# EAGLE design sb2 (EAGLE 8.3.1)
COMPANY: ADAFRUIT INDUSTRIES; DRAWN: KTOWN; REV: B
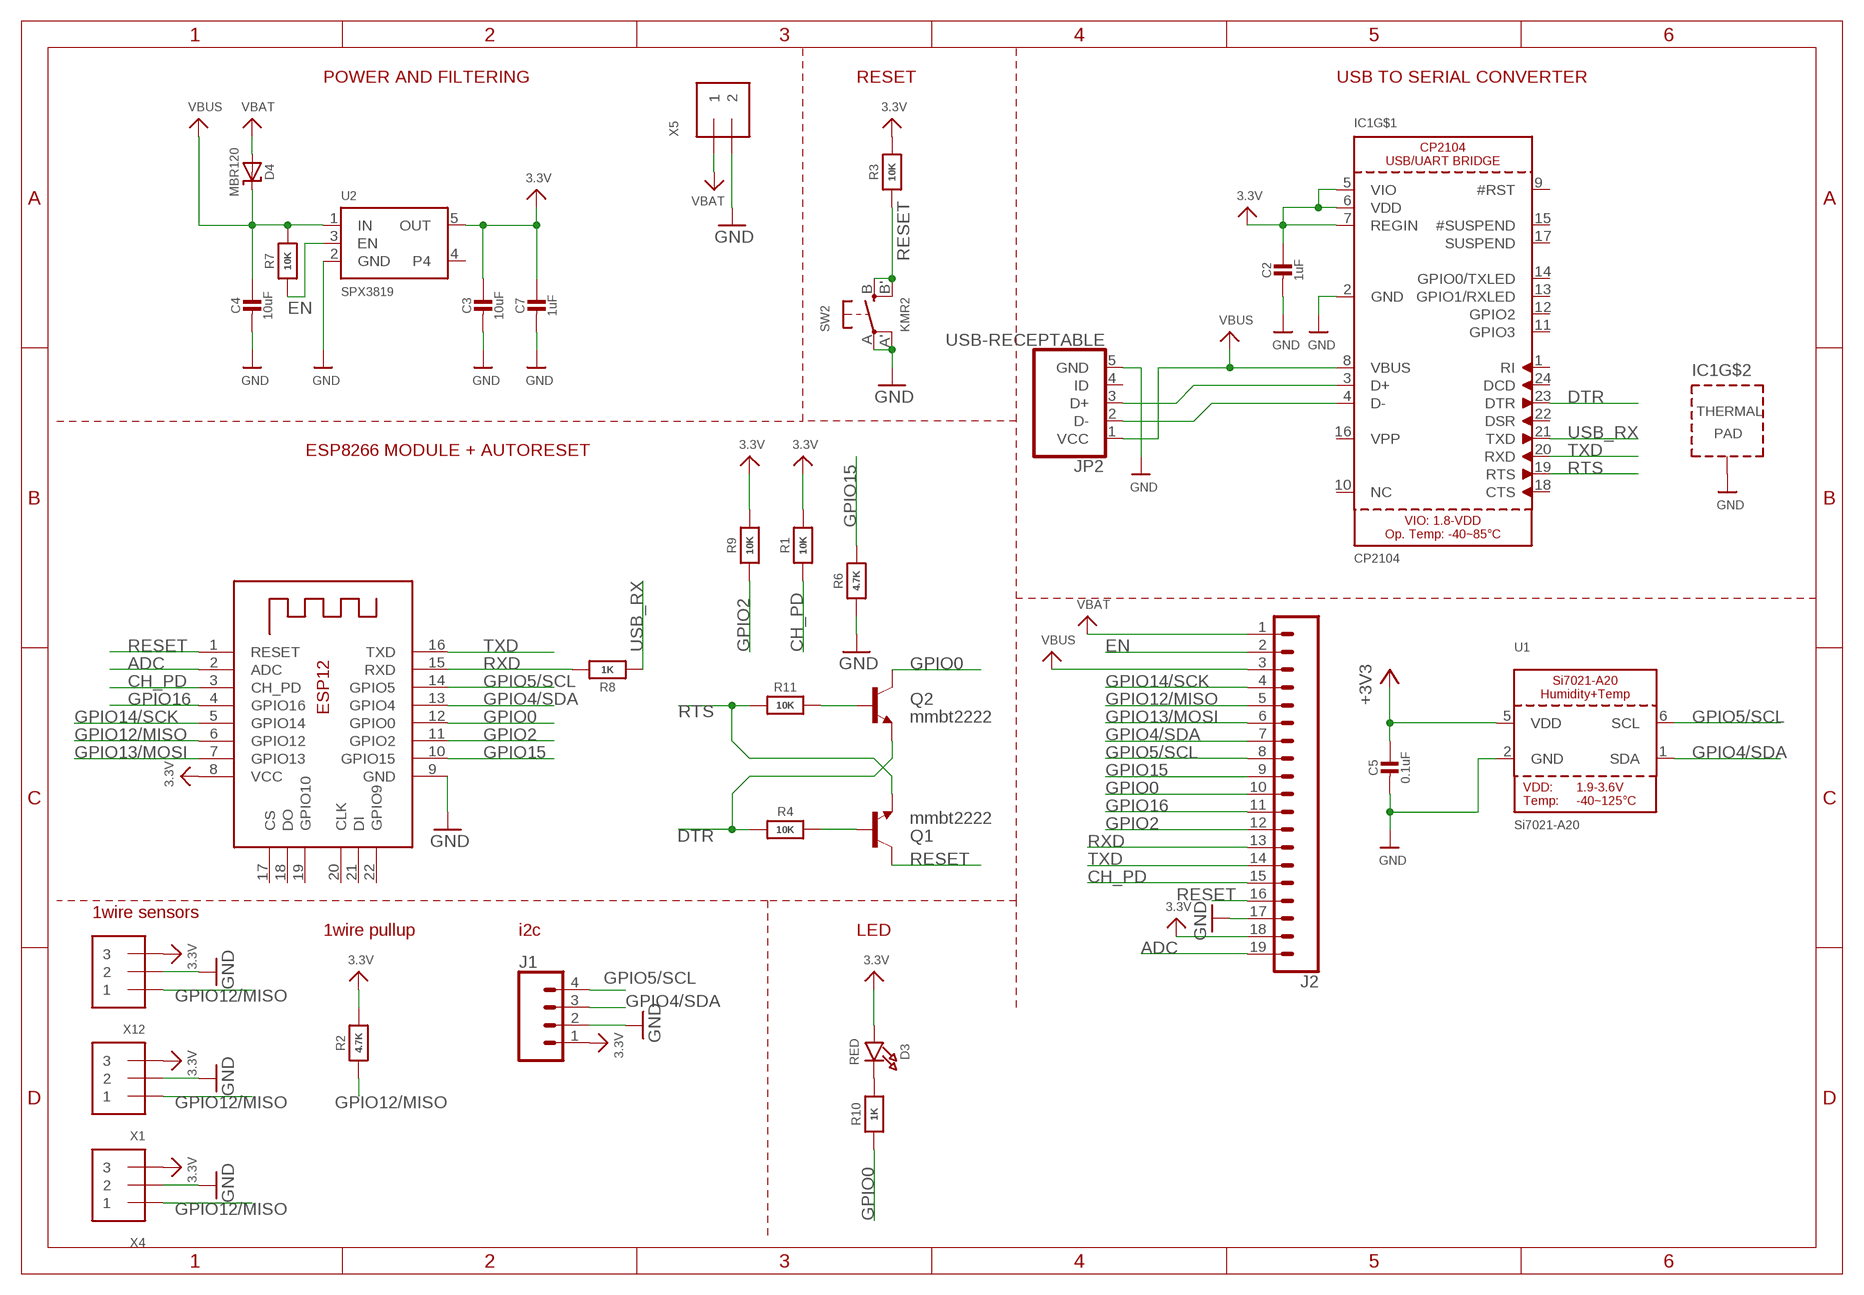
[diagram p0: schematic, sheet 1]

## Parts
C2  1uF  CAP_CERAMIC0603_NO  [0603-NO]
C3  10uF  CAP_CERAMIC0603_NO  [0603-NO]
C4  10uF  CAP_CERAMIC0603_NO  [0603-NO]
C5  0.1uF  CAP_CERAMIC0603_NO  [0603-NO]
C7  1uF  CAP_CERAMIC0603_NO  [0603-NO]
D3  RED  LED0805_NOOUTLINE  [CHIPLED_0805_NOOUTLINE]
D4  MBR120  DIODE-SCHOTTKYSOD-123  [SOD-123]
IC1  CP2104  [QFN24_4MM_SMSC]
J1  CONN_04SCREW  [SCREWTERMINAL-3.5MM-4]
J2  CONN_19  [1X19]
JP2  USB-RECEPTABLE  [FCI-10103594-0001LF]
Q1  mmbt2222  TRANSISTOR_NPNSOT23-3  [SOT23-3]
Q2  mmbt2222  TRANSISTOR_NPNSOT23-3  [SOT23-3]
R1  10K  RESISTOR_0603_NOOUT  [0603-NO]
R2  4.7K  RESISTOR_0603_NOOUT  [0603-NO]
R3  10K  RESISTOR_0603_NOOUT  [0603-NO]
R4  10K  RESISTOR_0603_NOOUT  [0603-NO]
R6  4.7K  RESISTOR_0603_NOOUT  [0603-NO]
R7  10K  RESISTOR_0603_NOOUT  [0603-NO]
R8  1K  RESISTOR_0603_NOOUT  [0603-NO]
R9  10K  RESISTOR_0603_NOOUT  [0603-NO]
R10  1K  RESISTOR_0603_NOOUT  [0603-NO]
R11  10K  RESISTOR_0603_NOOUT  [0603-NO]
SW2  KMR2  SWITCH_TACT_SMT4.6X2.8  [BTN_KMR2_4.6X2.8]
U1  Si7021-A20  SI7021-A20  [DFN6_3X3_SI]
U2  SPX3819  VREG_SOT23-5  [SOT23-5]
X1  TERMBLOCK_1X3  [TERMBLOCK_1X3-3.5MM]
X2  ESP-12  ESP-12E  [ESP-12E]
X4  TERMBLOCK_1X3  [TERMBLOCK_1X3-3.5MM]
X5  TERMBLOCK_1X2  [TERMBLOCK_1X2-3.5MM]
X12  TERMBLOCK_1X3  [TERMBLOCK_1X3-3.5MM]

## Nets
3.3V: C2.1 C3.1 C7.1 D3.A IC1.5(VIO) IC1.6(VDD) IC1.7(REGIN) J1.1 J2.18 R1.2 R2.2 R3.2 R9.2 U2.5(OUT) X1.3 X2.8(VCC) X4.3 X12.3
+3V3: C5.1 U1.5(VDD)
ADC: J2.19 X2.2(ADC)
CH_PD: J2.15 R1.1 X2.3(CH_PD)
DTR: IC1.23(DTR) Q2.2(E) R4.1
EN: J2.2 R7.1 U2.3(EN)
GND: C2.2 C3.2 C4.2 C5.2 C7.2 IC1.2(GND) IC1.THERM(TP) J1.2 J2.17 JP2.5(GND) R6.1 SW2.A'(P1) SW2.A(P) U1.2(GND) U2.2(GND) X1.2 X2.9(GND) X4.2 X5.2 X12.2
GPIO0: J2.10 Q2.3(C) R10.1 X2.12(GPIO0)
GPIO2: J2.12 R9.1 X2.11(GPIO2)
GPIO4/SDA: J1.3 J2.7 U1.1(SDA) X2.13(GPIO4)
GPIO5/SCL: J1.4 J2.8 U1.6(SCL) X2.14(GPIO5)
GPIO12/MISO: J2.5 R2.1 X1.1 X2.6(GPIO12) X4.1 X12.1
GPIO13/MOSI: J2.6 X2.7(GPIO13)
GPIO14/SCK: J2.4 X2.5(GPIO14)
GPIO15: J2.9 R6.2 X2.10(GPIO15)
GPIO16: J2.11 X2.4(GPIO16)
N$2: IC1.3(D+) JP2.3(D+)
N$5: D3.C R10.2
N$6: IC1.4(D-) JP2.2(D-)
N$12: Q1.1(B) R4.2
N$13: Q2.1(B) R11.2
RESET: J2.16 Q1.3(C) R3.1 SW2.B'(S1) SW2.B(S) X2.1(RESET)
RTS: IC1.19(RTS) Q1.2(E) R11.1
RXD: J2.13 R8.2 X2.15(RXD)
TXD: IC1.20(RXD) J2.14 X2.16(TXD)
USB_RX: IC1.21(TXD) R8.1
VBAT: D4.A J2.1 X5.1
VBUS: C4.1 D4.C IC1.8(VBUS) J2.3 JP2.1(VCC) R7.2 U2.1(IN)
Unconnected: IC1.1(RI) IC1.9(#RST) IC1.10(NC) IC1.11(GPIO3) IC1.12(GPIO2) IC1.13(GPIO1/RXLED) IC1.14(GPIO0/TXLED) IC1.15(#SUSPEND) IC1.16(VPP) IC1.17(SUSPEND) IC1.18(CTS) IC1.22(DSR) IC1.24(DCD) JP2.4(ID) U2.4 X2.17(CS) X2.18(DO) X2.19(GPIO10) X2.20(CLK) X2.21(DI) X2.22(GPIO9)

## Notes on the sheet
- POWER AND FILTERING | RESET | USB TO SERIAL CONVERTER
- ESP8266 MODULE + AUTORESET
- 1wire sensors
- 1wire pullup | i2c | LED

## Library data of the parts
C2-C5 C7 = microbuilder:CAP_CERAMIC: Ceramic Capacitors For new designs, use the packages preceded by an '_' character since they are more reliable: The following footprints should be used on most boards: _0402 - Standard footprint for regular board layouts _0603 - Standard footprint for regular board layouts _0805 - Standard footprint for regular board layouts _1206 - Standard footprint for regular board layouts For extremely tight-pitch boards where space is at a premium, the following 'micro-pitch' footprints can be used (smaller pads, no silkscreen outline, etc.): _0402MP - Micro-pitch footprint for very dense/compact boards _0603MP - Micro-pitch footprint for very dense/compact boards _0805MP - Micro-pitch footprint for very dense/compact boards _1206MP - Micro-pitch footprint for very dense/compact boards
D3 = microbuilder:LED: LED 0603 - 0603 Surface Mount Package 2mA: Green LED - Low Power (3.9mcd, 2ma, 1.7Vf) - Digikey: 475-2709-2-ND Orange LED - Low Power (9.8mcd, 2ma, 1.8Vf) - Digikey: 475-1194-2-ND Red LED - Low Power (5mcd, 2ma, 1.8Vf) - Digikey: 475-1195-2-ND Yellow LED - Low Power (7mcd, 2ma, 1.8Vf) - Digikey: 475-1196-2-ND 5mA: Blue LED - Low Power (17mcd, 5ma, 2.9Vf) - Digikey: LNJ937W8CRACT-ND 0805 - 0805 Surface Mount Package 2mA: Red LED (8.8mcd, 2mA, 1.8Vf, Clear) - Low Power [Digikey: 475-2510-1-ND] Green LED (5mcd, 2mA, 1.8Vf, Clear) - Low Power [Digikey: 475-2730-1-ND] Yellow LED (11.3mcd, 2mA, 1.8Vf, Clear) - Low Power [Digikey: 475-2555-1-ND] 20mA: Red LED (104mcd, 20mA, Diffused) - LS R976 [Digikey: 475-1278-6-ND] Red LED (12mcd, 20mA, 2.0Vf, Clear) - APT2012EC [Digikey: 754-1128-1-ND] Green LED (15mcd, 20mA, 2.2Vf, Clear) - APT2012GC [Digikey: 754-1131-1-ND] Orange LED (160mcd, 20mA, 2.1Vf, Clear) - APT2012SECK [Digikey: 754-1130-1-ND] 1206 - 1206 Surface Mount Package Green LED (26mcd, 20mA, Diffused) - LG N971 [Digikey: 475-1407-6-ND] Red LED (15mcd, 20mA, Diffused) - LH N974 [Digikey: 475-1416-6-ND] Cree - Cree High-Power Surface Mount LEDs XPEBWT-L1-0000-00D50 - White 111lm 350mA 2.9Vf 6200K 110° XTEAWT-00-0000-00000LEE3 - White 114lm 350mA 2.85Vf 5000K 115° Everlight - Everlight 45-21 Series Surface Mount LEDs 45-21/QK2C-B2832AC2CB2/2T - Warm White 2000mcd 20mA 3.25Vf 3050K 120° 45-21/LK2C-B38452C4CB2/2T - Nuetral White 2000mcd 20mA 3.25Vf 4150K 120° 45-21/LK2C-B50634C6CB2/2T - Cold White 2200mcd 20mA 3.25Vf 5650K 120° PLCC2 Reverse Mount LS T77K-J1L2-1-0-2-R18-Z - Red 11.25mcd 2mA 1.8Vf 630nm 120° LO T77K-L1M2-24-Z - Orange 19.6mcd 2mA 1.8Vf 606nm 120° LY T77K-K2M1-26-Z - Yellow 15.7mcd 2mA 1.8Vf 587nm 120°
D4 = microbuilder:DIODE-SCHOTTKY
IC1 = microbuilder:CP2104: CP2104 - USB to UART Bridge VDD Output: 3.45V
J1 = SparkFun-Connectors:CONN_04: Multi connection point. Often used as Generic Header-pin footprint for 0.1 inch spaced/style header connections On any of the 0.1 inch spaced packages, you can populate with these: Break Away Headers - Straight <https://www.sparkfun.com/products/116> (PRT-00116) Break Away Male Headers - Right Angle <https://www.sparkfun.com/products/553> (PRT-00553) Female Headers <https://www.sparkfun.com/products/115> (PRT-00115) Break Away Headers - Machine Pin <https://www.sparkfun.com/products/117> (PRT-00117) Break Away Female Headers - Swiss Machine Pin <https://www.sparkfun.com/products/743> (PRT-00743) For SCREWTERMINALS and SPRING TERMINALS visit here: Screw Terimnals on SparkFun.com <https://www.sparkfun.com/search/results?term=Screw+Terminals> (5mm/3.5mm/2.54mm spacing) This device is also useful as a general connection point to wire up your design to another part of your project. Our various solder wires solder well into these plated through hole pads. Hook-Up Wire - Assortment (Stranded, 22 AWG) <https://www.sparkfun.com/products/11375> (PRT-11375) Hook-Up Wire - Assortment (Solid Core, 22 AWG) <https://www.sparkfun.com/products/11367> (PRT-11367) View the entire wire category on our website here <https://www.sparkfun.com/categories/141> Special notes: Molex polarized connector foot print use with SKU : PRT-08231 with associated crimp pins and housings. 1MM SMD Version SKU: PRT-10208; PROD_ID: 2xCONN-08399; SF_ID: 2xPRT-08084
J2 = SparkFun-Connectors:CONN_19: Multi connection point. Often used as Generic Header-pin footprint for 0.1 inch spaced/style header connections On any of the 0.1 inch spaced packages, you can populate with these: Break Away Headers - Straight <https://www.sparkfun.com/products/116> (PRT-00116) Break Away Male Headers - Right Angle <https://www.sparkfun.com/products/553> (PRT-00553) Female Headers <https://www.sparkfun.com/products/115> (PRT-00115) Break Away Headers - Machine Pin <https://www.sparkfun.com/products/117> (PRT-00117) Break Away Female Headers - Swiss Machine Pin <https://www.sparkfun.com/products/743> (PRT-00743) For SCREWTERMINALS and SPRING TERMINALS visit here: Screw Terimnals on SparkFun.com <https://www.sparkfun.com/search/results?term=Screw+Terminals> (5mm/3.5mm/2.54mm spacing) This device is also useful as a general connection point to wire up your design to another part of your project. Our various solder wires solder well into these plated through hole pads. Hook-Up Wire - Assortment (Stranded, 22 AWG) <https://www.sparkfun.com/products/11375> (PRT-11375) Hook-Up Wire - Assortment (Solid Core, 22 AWG) <https://www.sparkfun.com/products/11367> (PRT-11367) View the entire wire category on our website here <https://www.sparkfun.com/categories/141> Special notes: Molex polarized connector foot print use with SKU : PRT-08231 with associated crimp pins and housings. 1MM SMD Version SKU: PRT-10208 NOTES ON THE VARIANTS LOCK and LOCK_LONGPADS... This footprint was designed to help hold the alignment of a through-hole component (i.e. 6-pin header) while soldering it into place. You may notice that each hole has been shifted either up or down by 0.005 of an inch from it's more standard position (which is a perfectly straight line). This slight alteration caused the pins (the squares in the middle) to touch the edges of the holes. Because they are alternating, it causes a "brace" to hold the component in place. 0.005 has proven to be the perfect amount of "off-center" position when using our standard breakaway headers. Although looks a little odd when you look at the bare footprint, once you have a header in there, the alteration is very hard to notice. Also,if you push a header all the way into place, it is covered up entirely on the bottom side.
JP2 = daspilker:USB-RECEPTABLE: USB Receptable
Q1 Q2 = SparkFun:TRANSISTOR_NPN: Transistor NPN BJT configuration in SOT23 package. MMBT2222 is the common NPN we use. Double check BCE configuration again layout.
R1-R4 R6-R11 = microbuilder:RESISTOR: Resistors For new designs, use the packages preceded by an '_' character since they are more reliable: The following footprints should be used on most boards: _0402 - Standard footprint for regular board layouts _0603 - Standard footprint for regular board layouts _0805 - Standard footprint for regular board layouts _1206 - Standard footprint for regular board layouts For extremely tight-pitch boards where space is at a premium, the following 'micro-pitch' footprints can be used (smaller pads, no silkscreen outline, etc.): _0402MP - Micro-pitch footprint for very dense/compact boards _0603MP - Micro-pitch footprint for very dense/compact boards _0805MP - Micro-pitch footprint for very dense/compact boards _1206MP - Micro-pitch footprint for very dense/compact boards
SW2 = microbuilder:SWITCH_TACT_SMT: SMT Tact Switches 6x6mm - Digikey: P12940SCT-ND KMR2 (4.6x2.8mm) - Digikey: 401-1426-1-ND EVQ-PQHB55 - Light Touch, 160GF (4.5x4.5mm) - Digikey: P8090SCT-ND KMT0 - KMT021 NGJ LHS (etc.) IP68/Waterproof - Digikey: CKN10289CT-ND
U1 = microbuilder:SI7021-A20: Si7021-A20 - I2C Humidity and Temperature Sensor VDD: 1.9-3.6V Operating Temperature: -40~125°C +/-3% RH (max) 0..80% RH Humidity Sensor +/-0.4°C (max-, -10~85°C Temperature Sensor 150uA Active, 60nA Standby
U2 = microbuilder:VREG_SOT23-5: SOT23-5 Fixed Voltage Regulators Part Current Out V Out V In V Dropout θJA (°C/W) TJ (°C) Digikey Part No. ADP121 150mA 3.3V 3.4-5.5V 0.09V @ 150mA -- -- ADP121-AUJZ33R7CT-ND ADP121 150mA 3.0V 3.1-5.5V 0.09V @ 150mA -- -- ADP121-AUJZ30R7CT-ND ADP122 300mA 3.3V 3.4-5.5V 0.085V @ 300mA -- -- ADP122AUJZ-3.3-R7CT-ND ADP1712 300mA 3.3V 3.5-5.5V 0.17V @ 300mA -- -- ADP1712AUJZ-3.3-R7TR-ND AP7311 (Low Cost) 150mA 3.3V 3.5-6V 0.15V @ 150mA -- -- AP7311-33WG-7DICT-ND LD39015M18R 150mA 1.8V 1.9V-5.5V 0.08V @ 100mA -- -- 497-6977-1-ND LP2985A-33DBVR 150mA 3.3V 3.3-16V 0.28V @ 150mA 206 150 296-18479-1-ND MCP1824T-3302E/OT 300mA 3.3V 3.5V-6V 0.2V @ 300mA -- -- MCP1824T-3302E/OTCT-ND MIC5205-2.5YM5 TR 150mA 2.5V 2.7-16V 0.165V @ 150mA -- -- 576-1257-2-ND MIC5205-3.0YM5 TR 150mA 3.0V 3.2V-16V 0.165V @ 150mA -- -- 576-1258-2-ND MIC5205-3.3YM5 TR 150mA 3.3V 3.5V-16V 0.165V @ 150mA -- -- 576-1259-2-ND TPS780330220 150mA 3.3V+2.2V 3.6-5.5V 250mV Max -- -- 296-23332-1-ND TDA3663/N1,135 100mA 3.3V 3.5-45V 0.18V @ 50mA -- -- 568-5343-1-ND Max operating temp can be calculated using θJA, TJ (max junction temperature), and power in watts. Set the "Maximum Ambient Temperature" until it reaches TJ ("Max Junction Temperature"), which is the absolute limit for safe use of the regulator: Heat Sink Temperature Calculator <http://www.daycounter.com/Calculators/Heat-Sink-Temperature-Calculator.phtml> For example, With 12V source into a 3.3V LP2985 and a 30mA load, we are dissipating (12V-3.3V) * 0.03A = 0.261W. With a θJA of 206 °C/W, a TJ of 150°C, and 261mW we can safely use the chip without a heat sink up to 75°C (=147.1°C Junction Temperature).
X1 X4 X12 = microbuilder:TERMBLOCK_1X3: 3.5mm Terminal block http://www.ladyada.net/library/pcb/eaglelibrary.html
X2 = microbuilder:ESP-12E
X5 = microbuilder:TERMBLOCK_1X2: 3.5mm Terminal block http://www.ladyada.net/library/pcb/eaglelibrary.html

## Board
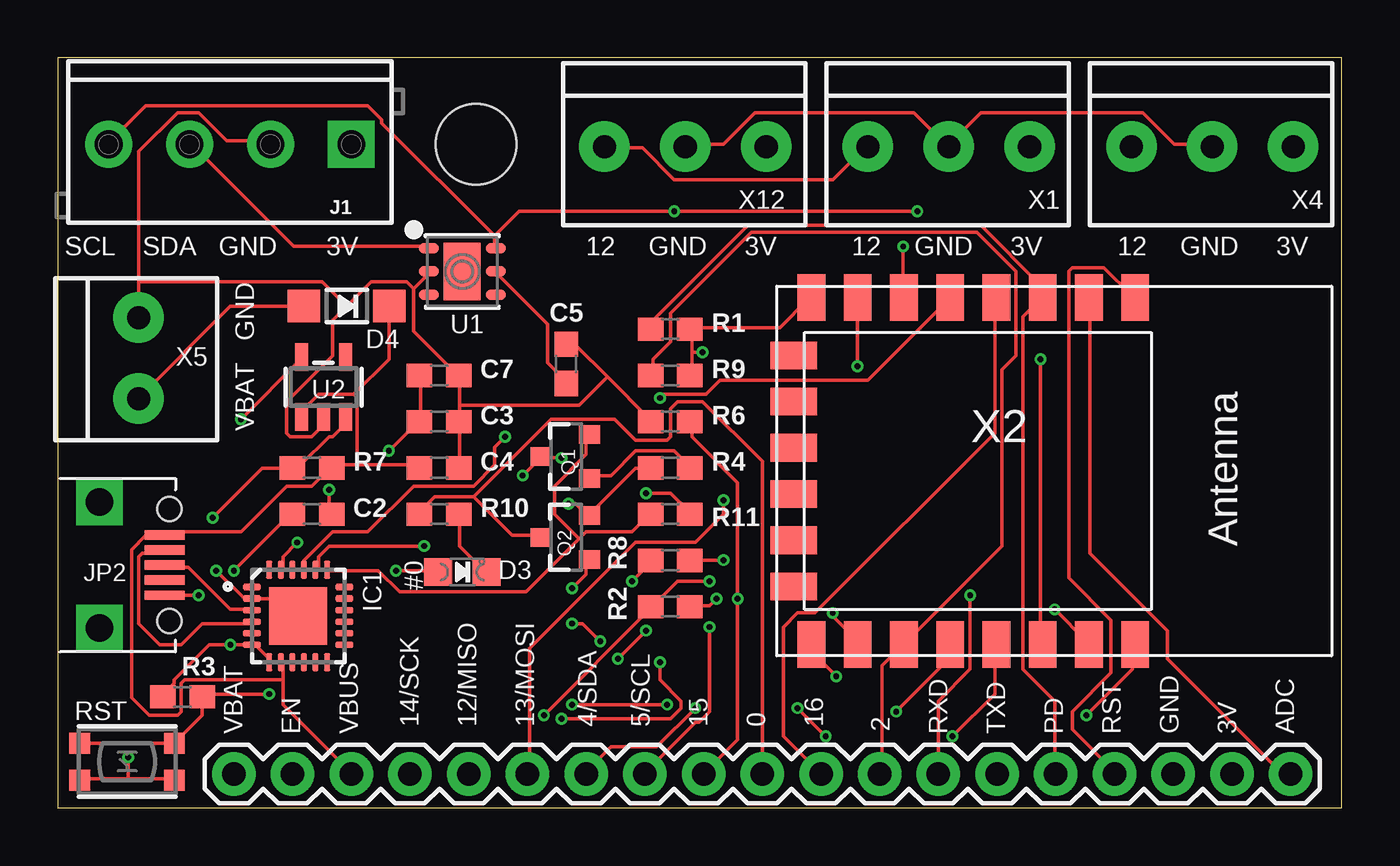
[diagram p1: board, top side]
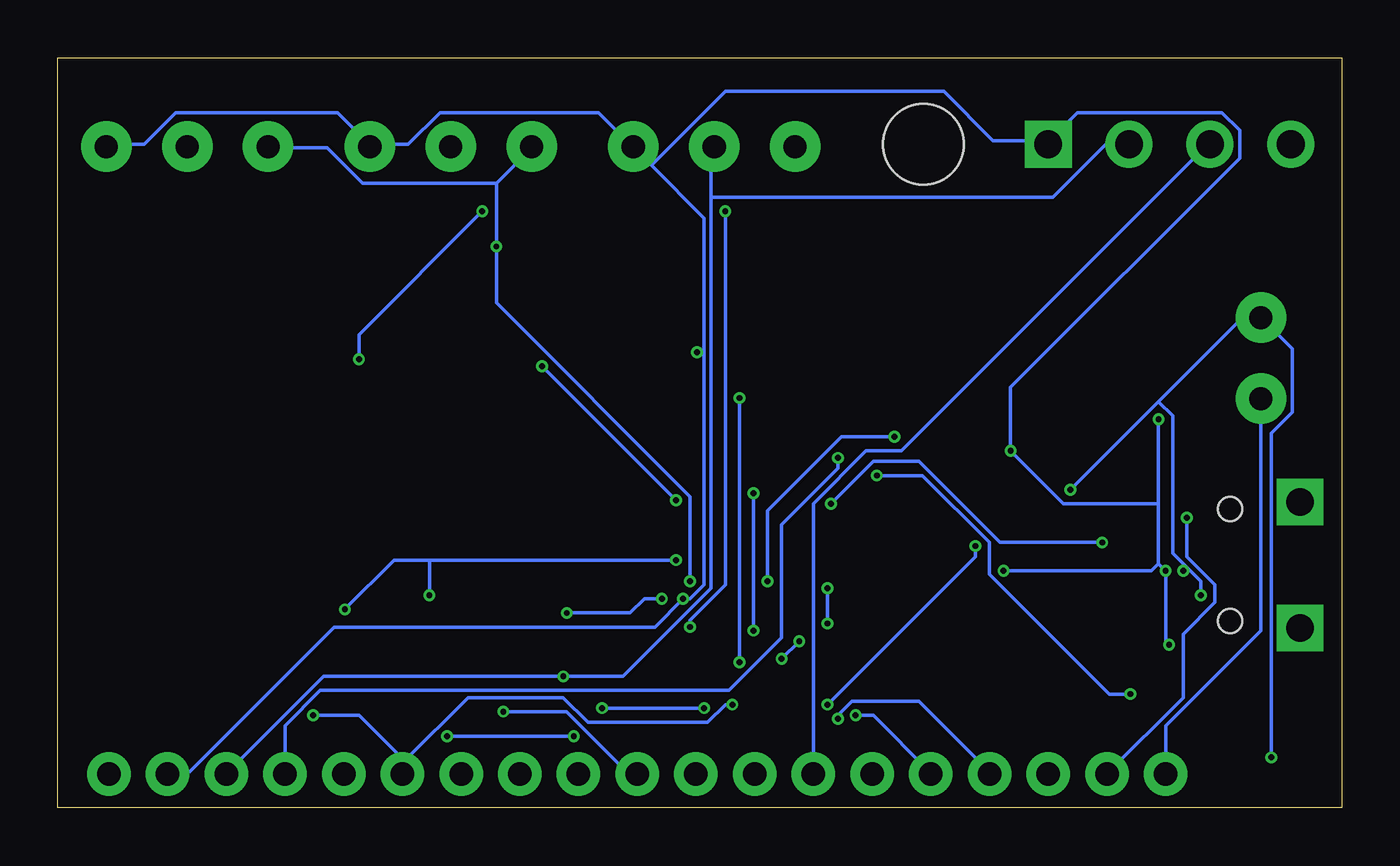
[diagram p2: board, bottom side, seen from below]

Size 55.55 x 32.44 mm. Coordinates in mm from the lower left corner, seen from the top.
Outline: 0,0 55.55,0 55.55,32.44 0,32.44 0,0
Copper layers (1*16): Top 0.035559375mm / dielectric 1.6mm / Bottom 0.035559375mm
Design rules "oshpark-2layer": minimum track width 6mil, minimum drill 10mil, track to track 6mil, track to pad 6mil, pad to pad 6mil, via to via 6mil, smd to smd 6mil, copper to edge 15mil, drill to drill 6mil, minimum pad ring 5mil, minimum via ring 5mil, stop-mask expansion 2.5mil, vias tented up to drill 0mil, thermal gap 10mil
Holes 3.5 mm at 18.1,28.7

### Footprints (pad centres in the part's own frame; a part is rotated, then mirrored left to right if it is on the bottom)
0603-NO = smd 1.1 x 1: 1 -0.85,0; 2 0.85,0
CHIPLED_0805_NOOUTLINE = smd 1.2 x 1.2: A 0,-1.05; C 0,1.05
SOD-123 = smd 1.4 x 1.4: A 1.85,0; C -1.85,0
QFN24_4MM_SMSC = smd 0.8 x 0.28: 1 -2,1.25; 2 -2,0.75; 3 -2,0.25; 4 -2,-0.25; 5 -2,-0.75; 6 -2,-1.25; 13 2,-1.25; 14 2,-0.75; 15 2,-0.25; 16 2,0.25; 17 2,0.75; 18 2,1.25 | smd 0.28 x 0.8: 7 -1.25,-2; 8 -0.75,-2; 9 -0.25,-2; 10 0.25,-2; 11 0.75,-2; 12 1.25,-2; 19 1.25,2; 20 0.75,2; 21 0.25,2; 22 -0.25,2; 23 -0.75,2; 24 -1.25,2 | smd 2.5 x 2.5: THERM 0,0
SCREWTERMINAL-3.5MM-4 = drill 1.2 pad 2.032 square: 1 0,0 | drill 1.2 pad 2.032: 2 3.5,0; 3 7,0; 4 10.5,0
1X19 = drill 1.016 pad 1.88: 1 0,0; 2 2.54,0; 3 5.08,0; 4 7.62,0; 5 10.16,0; 6 12.7,0; 7 15.24,0; 8 17.78,0; 9 20.32,0; 10 22.86,0; 11 25.4,0; 12 27.94,0; 13 30.48,0; 14 33.02,0; 15 35.56,0; 16 38.1,0; 17 40.64,0; 18 43.18,0; 19 45.72,0
FCI-10103594-0001LF = smd 0.4 x 1.75: 1 -1.3,4.525; 2 -0.65,4.525; 3 0,4.525; 4 0.65,4.525; 5 1.3,4.525 | drill 1.2 pad 2 square: P$3 -2.725,1.7; P$4 2.725,1.7 | hole 1.05: -2.425,4.73; 2.425,4.73
SOT23-3 = smd 0.8 x 0.9: 1 -0.95,-1; 2 0.95,-1; 3 0,1.1
BTN_KMR2_4.6X2.8 = smd 0.9 x 0.9: A 2.05,0.8; A' -2.05,0.8; B 2.05,-0.8; B' -2.05,-0.8
DFN6_3X3_SI = smd 0.85 x 0.45: 1 -1.45,1; 2 -1.45,0; 3 -1.45,-1; 4 1.45,-1; 5 1.45,0; 6 1.45,1 | smd 1.6 x 2.5: P$1 0,0
SOT23-5 = smd 0.55 x 1.2: 1 -0.95,-1.3; 2 0,-1.3; 3 0.95,-1.3; 4 0.95,1.3; 5 -0.95,1.3
TERMBLOCK_1X3-3.5MM = drill 1 pad 2.184: 1 3.55,0; 2 0.05,0; 3 -3.45,0
ESP-12E = smd 2 x 1.2: 1 -7.5,5.77; 2 -7.5,3.77; 3 -7.5,1.77; 4 -7.5,-0.23; 5 -7.5,-2.23; 6 -7.5,-4.23; 7 -7.5,-6.23; 8 -7.5,-8.23; 9 7.5,-8.23; 10 7.5,-6.23; 11 7.5,-4.23; 12 7.5,-2.23; 13 7.5,-0.23; 14 7.5,1.77; 15 7.5,3.77; 16 7.5,5.77 | smd 1.2 x 2: 17 -5,-9; 18 -3,-9; 19 -1,-9; 20 1,-9; 21 3,-9; 22 5,-9
TERMBLOCK_1X2-3.5MM = drill 1 pad 2.184: 1 1.8,0; 2 -1.7,0

### Placement (x,y rotation side)
C2  11,12.7 0 top
C3  16.5,16.7 0 top
C4  16.5,14.7 0 top
C5  22,19.2 90 top
C7  16.5,18.7 0 top
D3  17.5,10.2 270 top
D4  12.5,21.7 180 top
IC1  10.4,8.3 0 top
J1  12.7,28.7 180 top
J2  7.62,1.47 0 top
JP2  0.1,10.5 270 top
Q1  22,15.2 90 top
Q2  22,11.7 90 top
R1  26.5,20.7 0 top
R2  26.5,8.7 0 top
R3  5.4,4.8 180 top
R4  26.5,14.7 0 top
R6  26.5,16.7 0 top
R7  11,14.7 0 top
R8  26.5,10.7 0 top
R9  26.5,18.7 0 top
R10  16.5,12.7 0 top
R11  26.5,12.7 0 top
SW2  3,2 180 top
U1  17.5,23.2 0 top
U2  11.5,18.2 0 top
X1  38.6,28.6 180 top
X2  40.84,14.57 270 top
X4  50,28.6 180 top
X5  3.5,19.5 270 top
X12  27.2,28.6 180 top

### Tracks (layer width: path | path; a pad name or v marks a point on that pad's centre or on a via)
3.3V  (via drill 0.25)
  Top 0.152: C7.1 15.7,18.64 15.7,16.81 C3.1 15.54,16.66 v14.33,15.44 | 8.38,7.06 8.38,7.52 IC1.5 | IC1.7 9.14,6.45 8.53,7.06 IC1.6 8.38,7.06 | 8.38,7.06 v7.47,7.06 6.55,7.06 5.03,5.53 5.03,5.38 4.57,4.92 R3.2 | v7.62,10.26 10.06,12.7 C2.1 | v7.92,16.81 10.52,19.4 U2.5 | v14.63,10.26 16.31,10.26 D3.A | 27.43,19.71 27.43,20.62 R1.2 27.43,20.77 31.24,20.77 32.46,21.99 X2.8 | 27.43,19.71 27.43,18.79 R9.2 | v28.5,9.04 28.19,8.73 27.43,8.73 R2.2 | v27.89,19.71 27.43,19.71
  Bottom 0.152: v7.47,7.06 7.62,7.21 v7.62,10.26 7.92,10.56 | 7.92,10.56 7.92,13.15 | 7.92,13.15 v7.92,16.81 | v14.63,10.26 8.23,10.26 7.92,10.56 | 7.92,13.15 12.04,13.15 v14.33,15.44 14.33,18.18 4.42,28.09 4.42,29.31 5.18,30.07 11.43,30.07 12.65,28.85 J1.1 12.8,28.85 15.09,28.85 17.22,30.98 26.67,30.98 29.87,27.78 | 27.58,19.71 27.58,25.5 29.87,27.78 | 27.58,19.71 27.58,9.65 28.19,9.04 v28.5,9.04 29.72,7.82 43.59,7.82 49.84,1.57 50.75,1.57 J2.18 | 29.87,27.78 30.63,28.55 X12.3 30.79,28.7 32.16,30.07 39.01,30.07 40.39,28.7 41.91,28.7 X1.3 42.06,28.7 43.43,30.07 50.44,30.07 51.82,28.7 53.34,28.7 X4.3 | 27.58,19.71 v27.89,19.71
+3V3
  Top 0.152: U1.5 19.05,23.06 21.18,20.93 21.18,19.25 21.95,18.49 C5.1
ADC
  Top 0.152: X2.2 44.65,21.99 44.65,11.02 48.01,7.67 48.01,6.45 52.88,1.57 53.34,1.57 J2.19
CH_PD
  Top 0.152: R1.1 25.76,20.77 25.76,21.08 29.87,25.19 39.93,25.19 42.52,22.6 42.52,22.15 X2.3 42.52,21.99 41.76,21.23 41.76,5.99 43.13,4.62 43.13,1.57 J2.15
DTR  (via drill 0.25)
  Top 0.152: v10.36,11.48 9.75,10.87 9.75,10.41 IC1.23 | v22.1,13.15 22.4,13.15 22.86,12.7 Q2.2 23.01,12.7 24.99,14.68 25.6,14.68 R4.1
  Bottom 0.152: v10.36,11.48 14.78,11.48 18.29,14.98 20.27,14.98 v22.1,13.15
EN  (via drill 0.25)
  Top 0.152: U2.3 12.34,16.81 12.34,16.51 11.89,16.05 11.73,16.05 10.52,14.83 10.21,14.83 R7.1 10.06,14.68 8.84,14.68 v6.71,12.54
  Bottom 0.152: v6.71,12.54 6.71,10.87 5.49,9.65 5.49,8.89 6.86,7.52 6.86,4.77 J2.2
GND  (via drill 0.25)
  Top 0.152: 23.77,18.64 25.6,16.81 R6.1 | 23.77,18.64 22.4,20.01 22.1,20.01 C5.2 | C4.2 17.37,14.83 17.37,16.66 C3.2 17.37,16.81 17.37,17.42 | 15.39,22.45 16,23.06 U1.2 | 15.39,22.45 15.39,20.62 17.22,18.79 C7.2 17.37,18.64 17.37,17.42 | 12.5,21.69 13.56,22.75 15.09,22.75 15.39,22.45 | 12.5,21.69 11.89,21.08 11.89,19.55 9.91,17.57 9.91,16.2 10.06,16.05 10.97,16.05 11.43,16.51 11.43,16.81 U2.2 | 23.77,18.64 22.55,17.42 17.37,17.42 | IC1.THERM 10.36,8.43 9.75,9.04 8.53,9.04 IC1.2 8.38,9.04 8.08,9.04 v6.86,10.26 | 3.05,1.27 5.03,1.27 SW2.A' | 3.05,1.27 1.07,1.27 SW2.A | v11.73,13.76 11.73,12.85 C2.2 | v6.1,9.19 4.72,9.19 JP2.5 | v3.05,2.18 3.05,1.27 | 3.5,22.75 3.5,21.23 X5.2 | 3.5,22.75 3.5,28.39 5.18,30.07 6.1,30.07 7.32,28.85 9.14,28.85 J1.2 | 12.5,21.69 11.43,22.75 3.5,22.75 | v33.68,5.69 32.61,6.75 32.61,7.06 X2.9 | X12.2 27.28,28.7 28.8,28.7 30.18,30.07 37.03,30.07 38.41,28.7 X1.2 38.56,28.7 39.93,30.07 46.94,30.07 48.31,28.7 49.84,28.7 X4.2
  Bottom 0.152: 7.92,17.57 4.42,21.08 3.5,21.08 X5.2 3.35,21.08 2.13,19.86 2.13,17.12 3.05,16.2 v3.05,2.18 | 7.92,17.57 v11.73,13.76 | v6.1,9.19 6.1,9.8 6.71,10.41 | 6.71,10.41 7.32,11.02 7.32,16.96 7.92,17.57 | 6.71,10.41 v6.86,10.26 | J2.17 44.04,5.69 v33.68,5.69 31.09,5.69 27.28,9.5 27.28,26.41 | 27.28,26.41 27.28,28.55 X12.2 | 27.28,26.41 12.5,26.41 10.21,28.7 9.3,28.7 J1.2
GPIO0  (via drill 0.25)
  Top 0.152: 17.98,13.46 19.66,11.78 20.88,11.78 Q2.3 | 17.98,13.46 16.31,13.46 15.7,12.85 R10.1 | v36.27,4.16 38.56,6.45 38.56,7.06 X2.12 | 17.98,13.46 21.34,16.81 24.08,16.81 24.99,15.9 26.36,15.9 26.52,16.05 26.52,17.27 26.82,17.57 27.89,17.57 30.48,14.98 J2.10
  Bottom 0.152: v36.27,4.16 33.53,4.16 30.94,1.57 30.48,1.57 J2.10
GPIO2
  Top 0.152: R9.1 25.76,18.79 25.76,19.4 26.52,20.16 26.52,21.38 30.02,24.89 39.78,24.89 41.45,23.21 41.45,19.55 40.84,18.95 40.84,11.32 36.73,7.21 X2.11 36.58,7.06 35.66,6.14 35.66,1.57 J2.12
GPIO4/SDA  (via drill 0.25)
  Top 0.152: U1.1 16,24.28 10.21,24.28 5.79,28.7 J1.3 | v38.71,3.1 40.54,4.92 40.54,7.06 X2.13 | v32,4.32 v33.22,3.1 | v27.58,4.32 25.91,2.64 23.93,2.64 22.86,1.57 J2.7
  Bottom 0.152: v33.22,3.1 v38.71,3.1 | v27.58,4.32 v32,4.32 | J2.7 22.86,13.15 20.57,15.44 19.05,15.44 5.79,28.7 J1.3
GPIO5/SCL  (via drill 0.25)
  Top 0.152: 18.9,24.74 18.9,24.28 U1.6 | 18.9,24.74 14.02,29.61 14.02,29.77 13.41,30.38 3.81,30.38 2.29,28.85 J1.4 | v42.52,19.4 42.52,7.21 X2.14 | v37.19,25.8 v26.67,25.8 19.96,25.8 18.9,24.74 | v28.19,7.82 28.19,4.16 27.74,3.71 27.58,3.71 25.45,1.57 J2.8
  Bottom 0.152: v42.52,19.4 42.52,20.47 v37.19,25.8 | v28.19,7.82 28.19,8.12 26.67,9.65 v26.67,25.8
GPIO12/MISO  (via drill 0.25)
  Top 0.152: v21.03,4.01 25.6,8.58 R2.1 25.76,8.73 26.82,9.8 v28.19,9.8 | v36.58,24.28 36.58,22.15 X2.6 | X12.1 23.77,28.55 25.3,28.55 26.67,27.18 33.53,27.18 34.9,28.55 X1.1
  Bottom 0.152: v21.03,4.01 20.27,4.01 17.83,1.57 J2.5 | 36.58,27.02 v36.58,24.28 36.58,21.84 28.19,13.46 v28.19,9.8 | 36.58,27.02 35.05,28.55 X1.1 | 36.58,27.02 42.37,27.02 43.89,28.55 46.33,28.55 X4.1
GPIO13/MOSI  (via drill 0.25)
  Top 0.152: v34.59,19.1 34.59,21.99 X2.7 | v28.8,13.31 28.8,12.7 27.58,11.48 24.99,11.48 20.42,6.91 20.42,1.57 J2.6
  Bottom 0.152: v28.8,13.31 v34.59,19.1
GPIO14/SCK  (via drill 0.25)
  Top 0.152: v26.06,17.73 26.21,17.88 28.04,17.88 28.65,18.49 35.05,18.49 38.56,21.99 X2.5 | v26.06,6.3 26.06,5.53 26.98,4.62 26.98,4.32 26.52,3.86 v21.79,3.86
  Bottom 0.152: v26.06,6.3 v26.06,17.73 | v21.79,3.86 21.79,4.01 21.18,4.62 18.29,4.62 15.24,1.57 J2.4
GPIO15  (via drill 0.25)
  Top 0.152: J2.9 29.41,2.94 v29.41,9.04 29.41,14.07 27.43,16.05 27.43,16.66 R6.2 | v33.53,8.43 33.53,8.28 34.59,7.21 X2.10
  Bottom 0.152: v33.53,8.43 30.79,8.43 30.18,9.04 v29.41,9.04
GPIO16
  Top 0.152: J2.11 31.39,3.1 31.39,7.82 32,8.43 32.77,8.43 40.54,16.2 40.54,21.99 X2.4
N$2
  Top 0.152: IC1.3 8.38,8.58 7.47,8.58 5.64,10.41 4.72,10.41 JP2.3
N$5
  Top 0.152: R10.2 17.37,12.7 17.37,11.32 18.44,10.26 D3.C
N$6
  Top 0.152: IC1.4 8.38,7.97 6.25,7.97 5.33,7.06 4.42,7.06 3.5,7.97 3.5,10.87 3.66,11.02 4.57,11.02 JP2.2
N$12
  Top 0.152: Q1.1 23.01,14.37 23.93,14.37 24.99,15.44 26.67,15.44 27.28,14.83 R4.2
N$13  (via drill 0.25)
  Top 0.152: v22.25,9.5 22.86,10.11 22.86,10.72 Q2.1 | v22.25,7.97 22.71,7.97 v23.47,7.21 | v25.45,7.67 v24.23,6.45 | v25.45,13.61 26.52,13.61 27.28,12.85 R11.2
  Bottom 0.152: v22.25,7.97 v22.25,9.5 | v24.23,6.45 v23.47,7.21 | v25.45,13.61 v25.45,7.67
RESET  (via drill 0.25)
  Top 0.152: SW2.B 1.07,2.79 5.03,2.79 SW2.B' 5.18,2.94 6.25,4.01 6.25,4.77 R3.1 6.4,4.92 v9.14,4.92 | v21.79,15.13 21.03,15.13 Q1.3 20.88,15.13 v20.12,14.37 | X2.1 46.48,22.15 45.26,23.36 43.89,23.36 43.74,23.21 43.74,9.95 45.57,8.12 45.57,5.84 43.89,4.16 43.89,3.4 45.72,1.57 J2.16
  Bottom 0.152: v21.79,15.13 21.79,14.68 24.23,12.24 24.23,7.36 26.52,5.08 44.2,5.08 45.72,3.55 J2.16 | v9.14,4.92 10.06,4.92 15.24,10.11 15.24,11.48 18.14,14.37 v20.12,14.37
RTS
  Top 0.152: 22.55,11.63 22.86,11.93 24.84,11.93 25.6,12.7 R11.1 | 22.55,11.63 20.27,9.34 14.78,9.34 13.87,10.26 11.73,10.26 IC1.19 | 22.55,11.63 21.49,12.7 21.49,13.92 22.86,15.29 22.86,16.05 Q1.2
RXD  (via drill 0.25)
  Top 0.152: v28.8,10.72 27.43,10.72 R8.2 | v43.13,8.58 44.5,7.21 X2.15 | J2.13 38.1,4.62 39.47,5.99 v39.47,9.19
  Bottom 0.152: 39.47,10.72 41,10.72 v43.13,8.58 | 39.47,10.72 v28.8,10.72 | 39.47,10.72 v39.47,9.19
TXD  (via drill 0.25)
  Top 0.152: v15.85,11.32 11.73,11.32 11.28,10.87 11.28,10.41 IC1.20 | v26.36,4.47 v22.25,4.47 | v44.5,4.01 46.48,5.99 46.48,7.06 X2.16
  Bottom 0.152: v15.85,11.32 15.85,10.87 v22.25,4.47 | v26.36,4.47 26.67,4.47 27.43,3.71 32.61,3.71 33.68,4.77 37.8,4.77 40.54,2.03 | 40.54,2.03 40.54,1.57 J2.14 40.54,2.03 | v44.5,4.01 42.52,4.01 40.54,2.03
USB_RX  (via drill 0.25)
  Top 0.152: v19.36,16.05 18.9,15.59 18.9,14.83 17.98,13.92 15.39,13.92 13.41,11.93 11.89,11.93 10.67,10.72 10.67,10.41 IC1.21 | v24.84,9.8 25.6,10.56 R8.1
  Bottom 0.152: v19.36,16.05 21.64,16.05 24.84,12.85 v24.84,9.8
VBAT
  Top 0.152: D4.A 10.52,21.69 7.47,21.69 3.5,17.73 X5.1
  Bottom 0.152: J2.1 7.62,3.55 3.5,7.67 3.5,17.57 X5.1
VBUS
  Top 0.152: 9.75,5.53 9.75,4.47 12.65,1.57 J2.3 | 9.75,5.53 9.75,6.3 IC1.8 | 12.95,14.83 15.54,14.83 C4.1 | 12.95,14.83 11.89,14.83 R7.2 11.73,14.68 10.97,13.92 9.91,13.92 7.92,11.93 4.72,11.93 JP2.1 4.57,11.78 3.81,11.78 3.2,11.17 3.2,4.77 3.96,4.01 5.18,4.01 5.33,4.16 5.33,5.38 5.49,5.53 9.75,5.53 | 12.8,17.88 11.28,17.88 10.67,17.27 10.67,16.96 U2.1 | 12.8,17.88 12.95,17.73 12.95,14.83 | 12.8,17.88 14.33,19.4 14.33,21.69 D4.C

### Text on the board
tPlace: SCL | SDA | GND | 3V | 12 | GND | 3V | 12 | GND | 3V | 12 | GND | 3V | GND | VBAT | #0 | D3 | RST | VBAT | EN | VBUS | 14/SCK | 12/MISO | 13/MOSI | 4/SDA | 5/SCL | 15 | 0 | 16 | 2 | RXD | TXD | PD | RST | GND | 3V | ADC